# EAGLE schematic SimpleTimerPCB (EAGLE 6.5.0)
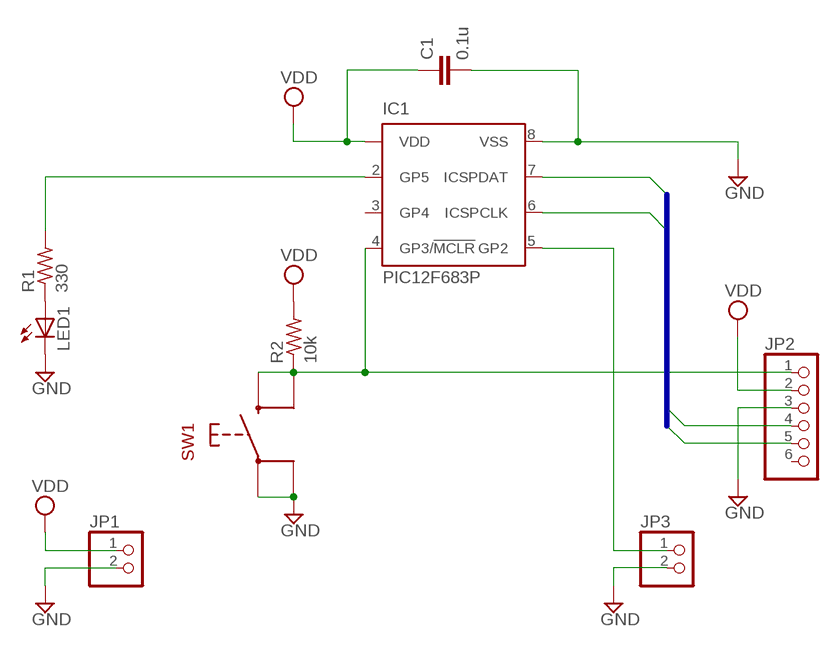
[diagram p0: schematic, sheet 1]

## Parts
C1  0.1u  C-EU050-024X044  [C050-024X044]
IC1  PIC12F683P  [DIL8]
JP1  PINHD-1X2  [1X02]
JP2  PINHD-1X6  [1X06]
JP3  PINHD-1X2  [1X02]
LED1  LED3MM  [LED3MM]
R1  330  R-US_0204/7  [0204/7]
R2  10k  R-US_0204/7  [0204/7]
SW1  TACT-SWITCH  [TACTSW-25X20]

## Nets
GND [Power]: C1.2 IC1.8(VSS) JP1.2 JP2.3 JP3.2 LED1.K(C) SW1.3(P1) SW1.4(P2)
N$1: LED1.A R1.1
N$2: IC1.4(GP3/!MCLR!) JP2.1 R2.1 SW1.1(S1) SW1.2(S2)
N$4: IC1.2(GP5) R1.2
N$6: IC1.5(GP2) JP3.1
PIN4: IC1.7(ICSPDAT) JP2.4
PIN5: IC1.6(ICSPCLK) JP2.5
VDD [Power]: C1.1 IC1.1(VDD) JP1.1 JP2.2 R2.2
Unconnected: IC1.3(GP4) JP2.6

## Buses
PIN[4..5]

## Library data of the parts
C1 = rcl:C-EU: CAPACITOR, European symbol
IC1 = MyParts:PIC12F683: 8-Pin Flash-Based, 8-Bit CMOS Microcontrollers with nanoWatt Technology Source: http://ww1.microchip.com/downloads/en/DeviceDoc/41211D_.pdf; MF: MICROCHIP; MPN: PIC12F683-I/P; OC_FARNELL: 9759034; OC_NEWARK: 89H0442
JP1 JP3 = pinhead:PINHD-1X2: PIN HEADER
JP2 = MyParts:PINHD-1X6: PIN HEADER
LED1 = led:LED: LED OSRAM: - CHIPLED LG R971, LG N971, LY N971, LG Q971, LY Q971, LO R971, LY R971 LH N974, LH R974 LS Q976, LO Q976, LY Q976 LO Q996 - Hyper CHIPLED LW Q18S LB Q993, LB Q99A, LB R99A - SideLED LS A670, LO A670, LY A670, LG A670, LP A670 LB A673, LV A673, LT A673, LW A673 LH A674 LY A675 LS A676, LA A676, LO A676, LY A676, LW A676 LS A679, LY A679, LG A679 - Hyper Micro SIDELED® LS Y876, LA Y876, LO Y876, LY Y876 LT Y87S - SmartLED LW L88C, LW L88S LB L89C, LB L89S, LG L890 LS L89K, LO L89K, LY L89K LS L896, LA L896, LO L896, LY L896 - TOPLED LS T670, LO T670, LY T670, LG T670, LP T670 LSG T670, LSP T670, LSY T670, LOP T670, LYG T670 LG T671, LOG T671, LSG T671 LB T673, LV T673, LT T673, LW T673 LH T674 LS T676, LA T676, LO T676, LY T676, LB T676, LH T676, LSB T676, LW T676 LB T67C, LV T67C, LT T67C, LS T67K, LO T67K, LY T67K, LW E67C LS E67B, LA E67B, LO E67B, LY E67B, LB E67C, LV E67C, LT E67C LW T67C LS T679, LY T679, LG T679 LS T770, LO T770, LY T770, LG T770, LP T770 LB T773, LV T773, LT T773, LW T773 LH T774 LS E675, LA E675, LY E675, LS T675 LS T776, LA T776, LO T776, LY T776, LB T776 LHGB T686 LT T68C, LB T68C - Hyper Mini TOPLED® LB M676 - Mini TOPLED Santana® LG M470 LS M47K, LO M47K, LY M47K Source: http://www.osram.convergy.de LUXEON: - LUMILED® LXK2-PW12-R00, LXK2-PW12-S00, LXK2-PW14-U00, LXK2-PW14-V00 LXK2-PM12-R00, LXK2-PM12-S00, LXK2-PM14-U00 LXK2-PE12-Q00, LXK2-PE12-R00, LXK2-PE12-S00, LXK2-PE14-T00, LXK2-PE14-U00 LXK2-PB12-K00, LXK2-PB12-L00, LXK2-PB12-M00, LXK2-PB14-N00, LXK2-PB14-P00, LXK2-PB14-Q00 LXK2-PR12-L00, LXK2-PR12-M00, LXK2-PR14-Q00, LXK2-PR14-R00 LXK2-PD12-Q00, LXK2-PD12-R00, LXK2-PD12-S00 LXK2-PH12-R00, LXK2-PH12-S00 LXK2-PL12-P00, LXK2-PL12-Q00, LXK2-PL12-R00 Source: www.luxeon.com KINGBRIGHT: KA-3528ASYC Source: www.kingbright.com
R1 R2 = rcl:R-US_: RESISTOR, American symbol
SW1 = MyParts:TACT-SWITCH: TACTICL SWITCH Tactible Switch; AKIZUKI-OC: P-03651

## Net classes
0 default: width 0.61 mm, clearance 0.508 mm
1 Power: width 0.914 mm, clearance 0.508 mm